# EasyEDA Pro project e_oct_dice_Dec_2022.eprj, board e_oct_dice_pcb_v0_5
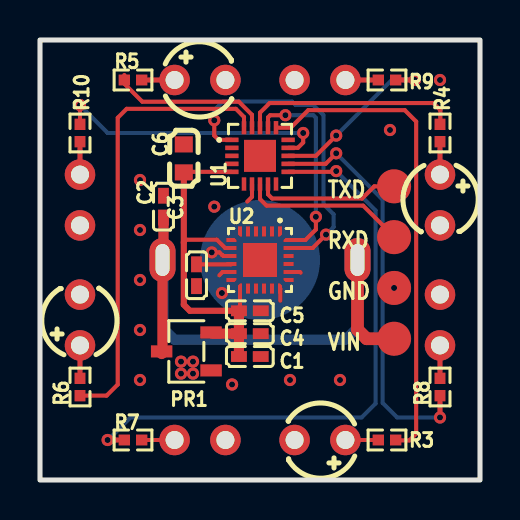
[diagram p13: board, top side]
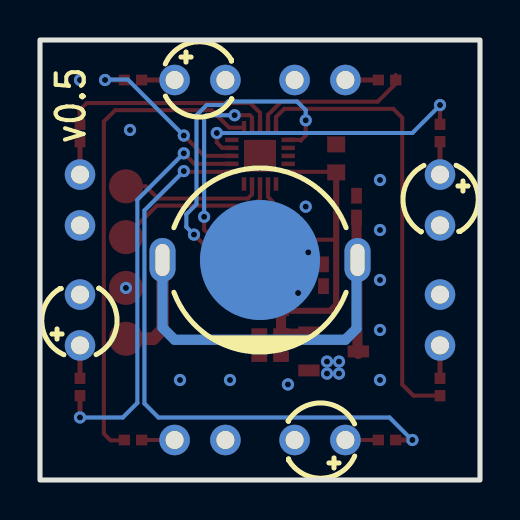
[diagram p14: board, bottom side, seen from below]

Outline 22 x 22 mm; copper layers: Top Layer, Bottom Layer. Coordinates in mm from the lower left corner of the outline.
Outline path: rectangle 0,22 22,0
Stack: Top Layer 0.035mm / Dielectric1 1.51mm FR4 er 4.5 / Bottom Layer 0.035mm

## Design rules (mm)
spacing safeClearance (default): track to track 0.152, other pairs 0.152 to 0.3
track width trackWidth (default): min 0.127, default 0.203, max 2.54
differential pair differentialPair (default): width min 0.127, default 0.254, max 2.54; gap min 0.152, default 0.152
via viaSize (default): diameter min 0.5, default 0.61, max 10; hole min 0.3, default 0.305, max 6
net GND uses copperRegion_BC

## Placement (name value [footprint] x y rotation side)
BT1  MY-927-01  [BAT-TH_MY-927-01]  11 11 180 bottom
C1  1uF  [C0402]  10.49 6.17 180 top
C2  1uF  [C0402]  6.17 13.67 270 top
C3  100nF  [C0402_NEW]  7.82 10.24 270 top
C4  10nF  [C0402]  10.49 7.32 0 top
C5  100nF  [C0402_NEW]  10.49 8.46 0 top
C6  22uF  [C0603]  7.19 16.08 270 top
LED1  PYR  [LED-TH_BD3.8-P2.54-FD_WHITE]  14 2 180 top
LED2  HYD  [LED-TH_BD3.8-P2.54-FD_WHITE]  20 14 270 top
LED3  ANE  [LED-TH_BD3.8-P2.54-FD_WHITE]  8 20 0 top
LED4  ELE  [LED-TH_BD3.8-P2.54-FD_WHITE]  2 8 90 top
LED5  DEN  [LED-TH_BD3.8-P2.54-FD_WHITE]  8 2 0 bottom
LED6  CYR  [LED-TH_BD3.8-P2.54-FD_WHITE]  20 8 90 bottom
LED7  GEO  [LED-TH_BD3.8-P2.54-FD_WHITE]  14 20 180 bottom
LED8  WLD  [LED-TH_BD3.8-P2.54-FD_WHITE]  2 14 270 bottom
NOREF  -  [Pad_e6186]  17.7 12.14 0 top
NOREF#2  -  [Pad_e6188]  17.7 7.06 0 top
NOREF#3  -  [Pad_e6185]  17.7 14.68 0 top
NOREF#4  -  [Pad_e6187]  17.7 9.6 0 top
PR1  XC6206P332MR  [SOT-23-3_L2.9-W1.6-P1.90-LS2.8-BR]  7.32 6.43 0 top
R3  470Ω  [R0402]  17.35 2 180 top
R4  470Ω  [R0402]  20 17.35 270 top
R5  470Ω  [R0402]  4.65 20 0 top
R6  470Ω  [R0402]  2 4.65 90 top
R7  470Ω  [R0402]  4.65 2 0 top
R8  470Ω  [R0402]  20 4.65 90 top
R9  470Ω  [R0402]  17.35 20 180 top
R10  470Ω  [R0402]  2 17.35 270 top
U1  STC8G1K17-38I-QFN20  [TQFN-20L_L3.0-W3.0-P0.40-BL-EP]  11 16.21 270 top
U2  MPU6500  [QFN-24_L3.0-W3.0-P0.40-BL-EP]  11 11 180 top

## Footprints (pads in the part's own frame, mm; a bottom-side part is the same pattern mirrored in y, then rotated)
BAT-TH_MY-927-01
  oval 1.3x2.2 hole 0.701x1.6: 1(-4.875,0) 1(4.875,0)
  round 6 smd: 2(0,0)
C0402
  rect 0.79x0.54 smd: 1(-0.545,0) 2(0.545,0)
C0402_NEW
  rect 0.79x0.54 smd: 1(-0.545,0) 2(0.545,0)
C0603
  rect 0.8x0.9 smd: 1(-0.7,0) 2(0.7,0)
LED-TH_BD3.8-P2.54-FD_WHITE
  round 1.524 hole 0.9: 1(-1.27,0) 2(1.27,0)
Pad_e6185
  round 1.7 smd: TP2(0,0)
Pad_e6186
  round 1.7 smd: TP3(0,0)
Pad_e6187
  round 1.7 smd: TP4(0,0)
Pad_e6188
  round 1.7 smd: TP5(0,0)
QFN-24_L3.0-W3.0-P0.40-BL-EP
  custom 0.2x0.506 smd: 1(-1,-1.427) 6(1,-1.427) 13(1,1.427) 18(-1,1.427)
  rect 0.2x0.505 smd: 2(-0.6,-1.427) 3(-0.2,-1.427) 4(0.2,-1.427) 5(0.6,-1.427) 14(0.6,1.427) 15(0.2,1.427) 16(-0.2,1.427) 17(-0.6,1.427)
  custom 0.506x0.2 smd: 7(1.427,-1) 12(1.427,1) 19(-1.427,1) 24(-1.427,-1)
  rect 0.505x0.2 smd: 8(1.427,-0.6) 9(1.427,-0.2) 10(1.427,0.2) 11(1.427,0.6) 20(-1.427,0.6) 21(-1.427,0.2) 22(-1.427,-0.2) 23(-1.427,-0.6)
  rect 1.7x1.7 smd: 25(0,0)
R0402
  rect 0.566x0.54 smd: 1(-0.433,0) 2(0.433,0)
SOT-23-3_L2.9-W1.6-P1.90-LS2.8-BR
  rect 1.07x0.6 smd: 1(1.235,-0.95) 2(1.235,0.95) 3(-1.235,0)
TQFN-20L_L3.0-W3.0-P0.40-BL-EP
  rect 0.224x0.665 smd: 1(-0.8,-1.407) 2(-0.4,-1.407) 3(0,-1.407) 4(0.4,-1.407) 5(0.8,-1.407) 11(0.8,1.407) 12(0.4,1.407) 13(0,1.407) 14(-0.4,1.407) 15(-0.8,1.407)
  rect 0.665x0.224 smd: 6(1.407,-0.8) 7(1.407,-0.4) 8(1.407,0) 9(1.407,0.4) 10(1.407,0.8) 16(-1.407,0.8) 17(-1.407,0.4) 18(-1.407,0) 19(-1.407,-0.4) 20(-1.407,-0.8)
  rect 1.6x1.6 smd: 21(0,0)

## Nets
As in the schematic, except:
GND: BT1.2 C1.1 C2.1 C3.2 C4.2 C5.2 C6.1 LED1.2 LED2.2 LED3.2 LED4.2 LED5.2 LED6.2 LED7.2 LED8.2 NOREF#4.TP4 PR1.1 U1.7 U2.9 U2.11 U2.18 U2.20
VIN: BT1.1 C2.2 NOREF#2.TP5 PR1.3
RXD: NOREF.TP3 U1.8
TXD: NOREF#3.TP2 U1.9

Pads without a net: U1 2 3 4 6 10 15 21; U2 1 2 3 4 5 6 7 12 14 15 16 17 19 21 22 25

## Via types
v1: diameter 0.61, hole 0.305, Top Layer to Bottom Layer, 21 vias
v2: diameter 0.61, hole 0.304, Top Layer to Bottom Layer, 9 vias

## Routing (per net, layer and track width the routed paths; a pad name or vN(x,y) marks a point on that pad's centre or on a via; arc(x,y) is an arc through that point)
GND: length 3.9
  Top Layer w0.203: v1(8.59,11.38) 8.97,11.38 9.11,11.24 9.12,11.24 9.17,11.2 U2.9 ; 12.02,8.97 12.02,9.56 U2.18 ; 13.03,10.36 13,10.4 U2.20 ; 10.37,13.92 10.6,14.16 U1.7 ; U2.11 9.13,10.4 8.97,10.24
  vias: v1(7.05,5.92) v1(7.05,5.32) v1(7.65,5.92) v1(7.65,5.32) v1(8.71,13.67) v1(9.09,9.35) v1(9.6,4.78) v1(17.7,9.6) v2(5,15) v2(5,12.5) v2(5,10) v2(5,7.5) v2(5,5) v2(12.5,5) v2(15,5) v2(17.5,17.5) v2(20,20)
VCC: length 19.2
  Top Layer w0.203: U1.5 7.22,15.41 7.13,15.32 ; 7.19,11.89 7.32,12.02 8.84,12.02 9.26,11.6 U2.8 ; U2.13 10,8.51 C5.1
  Top Layer w0.305: 7.13,15.32 7.19,15.26 7.19,8.77 7.5,8.46 C5.1
  Top Layer w0.508: C5.1 C4.1 8.61,7.32 ; 9.95,7.19 C1.2
VIN: length 29.4
  Top Layer w0.508: 6.08,6.3 6.13,6.34 BT1.1 6.17,11.05 C2.2
  Top Layer w0.635: NOREF#2.TP5 16.33,7.06 15.87,7.52 BT1.1
  Bottom Layer w0.508: BT1.1 15.87,7.62 15.27,7.01 6.73,7.01 6.17,7.57 6.17,10.95 BT1.1
LED_ANE: length 8.1
  Top Layer w0.203: 4.22,20.25 4.22,19.81 5.12,18.91 9.94,18.91 10.6,18.26 U1.19
LED_CYR: length 20.3
  Top Layer w0.203: 12.41,15.81 14.28,15.81 v1(14.81,16.33)
  Top Layer w0.254: v1(20,3.13) R8.1
  Bottom Layer w0.203: v1(14.81,16.33) 17.13,14.01 17.13,3.85 17.86,3.13 v1(20,3.13)
LED_DEN: length 29.8
  Top Layer w0.203: v1(14.81,15.44) 14.77,15.41 U1.11
  Top Layer w0.254: v1(3.38,2) R7.1
  Bottom Layer w0.203: v1(3.38,2) 3.4,2 4.52,3.13 16.08,3.13 16.78,3.82 16.78,13.48 v1(14.81,15.44)
LED_ELE: length 22.7
  Top Layer w0.203: R6.1 3.33,4.22 3.89,4.78 3.89,18.11 4.34,18.56 9.79,18.56 10.2,18.15 U1.20
LED_GEO: length 8.9
  Top Layer w0.203: v1(14.81,17.22) 13.79,16.21 U1.13
  Top Layer w0.254: v1(18.75,20) R9.1
  Bottom Layer w0.203: v1(14.81,17.22) 17.6,20.02 18.73,20.02 v1(18.75,20)
LED_HYD: length 10.8
  Top Layer w0.203: U1.18 11,18.37 11.48,18.85 19.66,18.85 20.02,18.49 20.02,17.8 R4.1
LED_PYR: length 24.4
  Top Layer w0.203: U1.16 12.53,17.61 13.41,18.49 18.24,18.49 18.81,17.92 18.81,2.31 18.48,1.98 17.75,1.98
LED_WLD: length 14.1
  Top Layer w0.203: v1(2,18.75) R10.1 ; v1(13.16,17.35) 13.16,16.87 12.89,16.61 U1.14
  Bottom Layer w0.203: 1.98,18.75 3.38,17.35 v1(13.16,17.35)
MPU_SCL: length 16.7
  Top Layer w0.203: 9.59,17.01 9.01,17.01 8.97,16.97 8.71,17.22 v1(8.71,17.98) ; v1(14.3,12.27) 13.63,11.6 U2.23
  Bottom Layer w0.203: v1(14.3,12.27) 14.68,12.65 14.68,13.29 14.18,13.79 14.18,18.24 13.67,18.75 12.78,18.75 12.6,18.92 9.15,18.92 8.71,18.49 v1(8.71,17.98)
MPU_SDA: length 10.2
  Top Layer w0.203: v1(13.79,13.16) 13.79,12.52 13.27,12 U2.24 ; v1(12.27,18.24) 11.51,18.24 11.4,18.13 U1.17
  Bottom Layer w0.203: v1(12.27,18.24) 13.67,18.24 13.79,18.11 v1(13.79,13.16)
RXD: length 8.3
  Top Layer w0.203: U1.8 11,14.05 11.33,13.72 16.16,13.72 17.73,12.14
TXD: length 7.2
  Top Layer w0.203: NOREF#3.TP2 16.72,14.68 16.11,14.07 11.61,14.07 11.4,14.28 U1.9
$1N2923: length 1.8
  Top Layer w0.203: U2.10 9.56,10.78 C3.1
$1N36634: length 1.6
  Top Layer w0.203: LED1.1 R3.2
$1N36786: length 1.6
  Top Layer w0.254: LED2.1 R4.2
$1N36892: length 1.6
  Top Layer w0.254: R5.2 LED3.1
$1N36980: length 1.6
  Top Layer w0.254: R6.2 LED4.1
$1N37068: length 1.6
  Top Layer w0.203: R7.2 LED5.1
$1N37156: length 1.6
  Top Layer w0.254: R8.2 LED6.1
$1N37244: length 1.6
  Top Layer w0.254: LED7.1 R9.2
$1N37332: length 1.6
  Top Layer w0.254: LED8.1 R10.2

## Copper pours and planes (outline as drawn; the poured copper is in the pictures)
GND on Top Layer: 0,22 22,22 22,0 0,0
GND on Bottom Layer: 0,22 22,22 22,0 0,0

## Text on the board
Bottom Silkscreen Layer: v0.5
Top Silkscreen Layer: TXD | RXD | GND | VIN
